# EAGLE design Lightsaber (EAGLE 9.6.2)
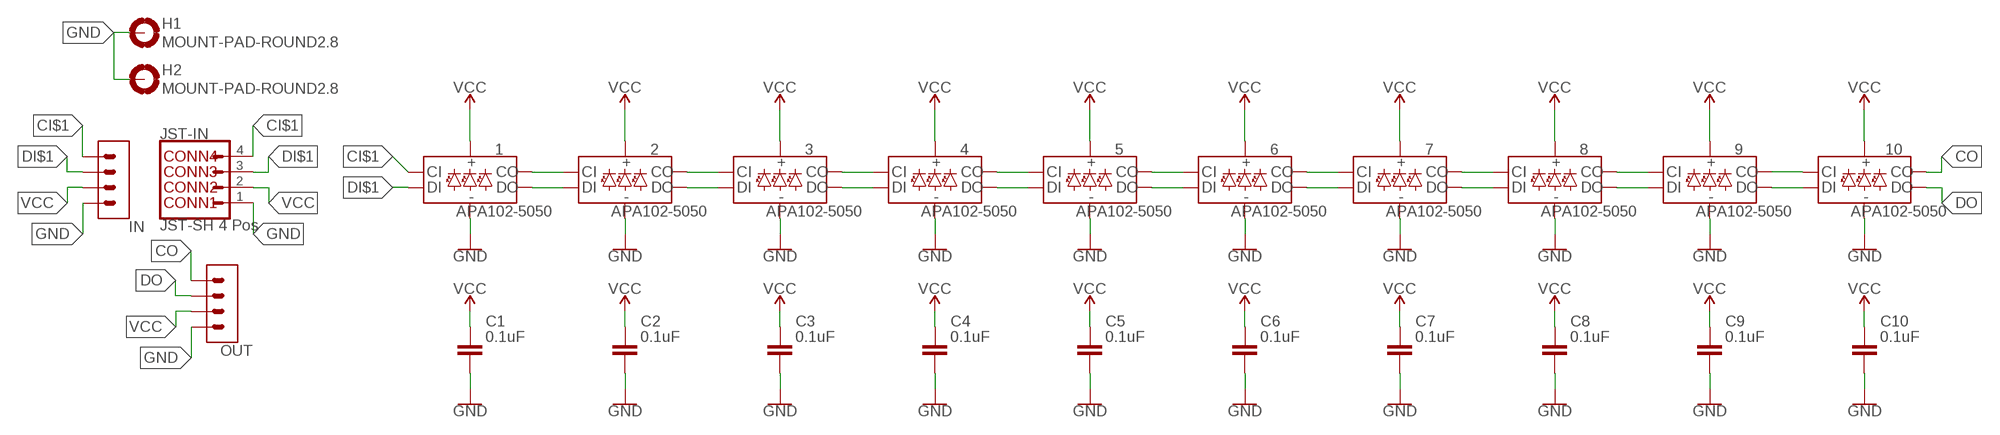
[diagram p0: schematic, sheet 1]

## Parts
1  APA102-5050  [APA102-5050]
2  APA102-5050  [APA102-5050]
3  APA102-5050  [APA102-5050]
4  APA102-5050  [APA102-5050]
5  APA102-5050  [APA102-5050]
6  APA102-5050  [APA102-5050]
7  APA102-5050  [APA102-5050]
8  APA102-5050  [APA102-5050]
9  APA102-5050  [APA102-5050]
10  APA102-5050  [APA102-5050]
C1  0.1uF  C_CHIP-0805(2012-METRIC)  [CAPC2012X110]
C2  0.1uF  C_CHIP-0805(2012-METRIC)  [CAPC2012X110]
C3  0.1uF  C_CHIP-0805(2012-METRIC)  [CAPC2012X110]
C4  0.1uF  C_CHIP-0805(2012-METRIC)  [CAPC2012X110]
C5  0.1uF  C_CHIP-0805(2012-METRIC)  [CAPC2012X110]
C6  0.1uF  C_CHIP-0805(2012-METRIC)  [CAPC2012X110]
C7  0.1uF  C_CHIP-0805(2012-METRIC)  [CAPC2012X110]
C8  0.1uF  C_CHIP-0805(2012-METRIC)  [CAPC2012X110]
C9  0.1uF  C_CHIP-0805(2012-METRIC)  [CAPC2012X110]
C10  0.1uF  C_CHIP-0805(2012-METRIC)  [CAPC2012X110]
H1  MOUNT-PAD-ROUND2.8  [2,8-PAD]
H2  MOUNT-PAD-ROUND2.8  [2,8-PAD]
IN  62000411121  [62000411121]
JST-IN  JST-SH 4 Pos  JST-4-SH  [JST04_1MM_VERT]
OUT  62000411121  [62000411121]

## Nets
CI$1: 1.P2(CI) IN.4 JST-IN.4
CI$2: 1.P5(CO) 2.P2(CI)
CI$3: 2.P5(CO) 3.P2(CI)
CI$4: 3.P5(CO) 4.P2(CI)
CI$5: 4.P5(CO) 5.P2(CI)
CI$6: 5.P5(CO) 6.P2(CI)
CI$7: 6.P5(CO) 7.P2(CI)
CI$8: 7.P5(CO) 8.P2(CI)
CI$9: 8.P5(CO) 9.P2(CI)
CI$10: 9.P5(CO) 10.P2(CI)
CO: 10.P5(CO) OUT.4
DI$1: 1.P1(DI) IN.3 JST-IN.3
DI$2: 1.P6(DO) 2.P1(DI)
DI$3: 2.P6(DO) 3.P1(DI)
DI$4: 3.P6(DO) 4.P1(DI)
DI$5: 4.P6(DO) 5.P1(DI)
DI$6: 5.P6(DO) 6.P1(DI)
DI$7: 6.P6(DO) 7.P1(DI)
DI$8: 7.P6(DO) 8.P1(DI)
DI$9: 8.P6(DO) 9.P1(DI)
DI$10: 9.P6(DO) 10.P1(DI)
DO: 10.P6(DO) OUT.3
GND: 1.P3(GND) 2.P3(GND) 3.P3(GND) 4.P3(GND) 5.P3(GND) 6.P3(GND) 7.P3(GND) 8.P3(GND) 9.P3(GND) 10.P3(GND) C1.2 C2.2 C3.2 C4.2 C5.2 C6.2 C7.2 C8.2 C9.2 C10.2 H1.B2,8(MOUNT) H2.B2,8(MOUNT) IN.1 JST-IN.1 OUT.1
VCC: 1.P4(VCC) 2.P4(VCC) 3.P4(VCC) 4.P4(VCC) 5.P4(VCC) 6.P4(VCC) 7.P4(VCC) 8.P4(VCC) 9.P4(VCC) 10.P4(VCC) C1.1 C2.1 C3.1 C4.1 C5.1 C6.1 C7.1 C8.1 C9.1 C10.1 IN.2 JST-IN.2 OUT.2

## Library data of the parts
1-10 = SparkFun-LED:APA102: Addressable RGB LED - 2 Wire Common names: APA102, Dotstar, etc. Packages: 5050 2020 SparkFun Products: SparkFun Lumenati Boards <https://www.sparkfun.com/categories/405>; PROD_ID: DIO-13739
C1-C10 = Capacitor:C: Capacitor - Generic; CATEGORY: Capacitor
H1 H2 = holes:MOUNT-PAD-ROUND: MOUNTING PAD, round
IN OUT = Headers:62000411121: THT Vertical Pin Header WR-PHD, Pitch 2.00 mm, Single Row, 4 pins Manufacturer's datasheet <https://datasheet.octopart.com/62000411121-W%C3%BCrth-Elektronik-datasheet-117282003.pdf>; CREATED_BY: PCBLayout.com; MANUFACTURER: Würth Elektronik; MPN: 62000411121
JST-IN = custom:JST-4-SH: JST-SH 4 position connector An SMD 1mm pitch JST-SH connector. Compatible with SparkFun Qwiic connectors.; PROD_ID: CONN-14483; VALUE: Vertical JST-SH 4 Position Connector

## Board
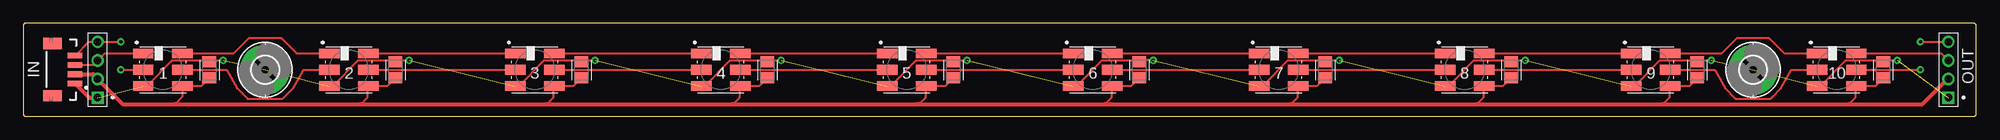
[diagram p1: board, top side]
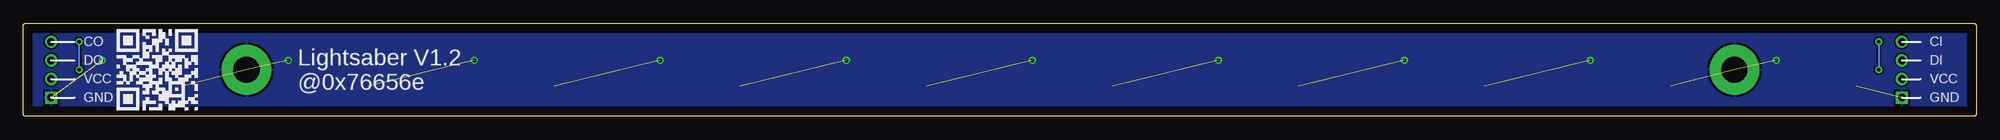
[diagram p2: board, bottom side, seen from below]

Size 210 x 10 mm. Coordinates in mm from the lower left corner, seen from the top.
Outline: 0,9.75 0,0.25 arc90 0.25,0 209.75,0 arc90 210,0.25 210,9.75 arc90 209.75,10 0.25,10 arc90 0,9.75
Copper layers (1*16): Top 0.035mm / dielectric 1.5mm / Bottom 0.035mm
Design rules "default *": minimum track width 6mil, minimum drill 0.35mm, track to track 6mil, track to pad 6mil, pad to pad 6mil, via to via 6mil, smd to smd 6mil, copper to edge 40mil, drill to drill 6mil, minimum pad ring 10mil, minimum via ring 8mil, stop-mask expansion 4mil, vias tented up to drill 0.36mm, thermal gap 10mil

### Footprints (pad centres in the part's own frame; a part is rotated, then mirrored left to right if it is on the bottom)
APA102-5050 = smd 1 x 2.2: P1 -1.75,-2.1; P3 1.75,-2.1; P4 1.75,2.1; P6 -1.75,2.1 | smd 1.1 x 2.2: P2 0,-2.1; P5 0,2.1
CAPC2012X110 = smd 1.165 x 1.465: 1 -0.875,0; 2 0.875,0
2,8-PAD = drill 2.8 pad 5.334: B2,8 0,0
62000411121 = drill 0.8 square: 1 -3,0 | drill 0.8: 2 -1,0; 3 1,0; 4 3,0
JST04_1MM_VERT = smd 0.6 x 1.55: 1 -1.478,0.775; 2 -0.478,0.775; 3 0.522,0.775; 4 1.522,0.775 | smd 1.2 x 2: NC1 -2.778,3.2; NC2 2.822,3.2

### Placement (x,y rotation side)
1  15,5 270 top
2  35,5 270 top
3  55,5 270 top
4  75,5 270 top
5  95,5 270 top
6  115,5 270 top
7  135,5 270 top
8  155,5 270 top
9  175,5 270 top
10  195,5 270 top
C1  20,5 90 top
C2  40,5 90 top
C3  60,5 90 top
C4  80,5 90 top
C5  100,5 90 top
C6  120,5 90 top
C7  140,5 90 top
C8  160,5 90 top
C9  180,5 90 top
C10  200,5 90 top
H1  26,5 0 top
H2  186,5 0 top
IN  8,5 90 top
JST-IN  6.35,5 90 top
OUT  207,5 90 top

### Tracks (layer width: path | path; a pad name or v marks a point on that pad's centre or on a via)
CI$1  (via drill 0.35)
  Top 0.2: JST-IN.4 7.05,8 IN.4 v10.5,8 | v10.5,5 1.P2
  Bottom 0.2: v10.5,8 v10.5,5
CI$2
  Top 0.2: 1.P5 21.87,5 23,3 24.12,1.88 27.88,1.88 29,3 30.13,5 2.P2
CI$3
  Top 0.2: 2.P5 3.P2
CI$4
  Top 0.2: 3.P5 4.P2
CI$5
  Top 0.2: 4.P5 5.P2
CI$6
  Top 0.2: 5.P5 6.P2
CI$7
  Top 0.2: 6.P5 7.P2
CI$8
  Top 0.2: 7.P5 8.P2
CI$9
  Top 0.2: 8.P5 9.P2
CI$10
  Top 0.152: 187.9,1.9 188.05,2.05
  Top 0.2: 9.P5 181.87,5 183,3 184.1,1.9 187.9,1.9 | 10.P2 190.13,5 189,3 188.05,2.05
CO  (via drill 0.35)
  Top 0.2: 10.P5 v204,5 | v204,8 OUT.4
  Bottom 0.2: v204,5 v204,8
DI$1
  Top 0.2: JST-IN.3 7.52,5.52 IN.3 8.75,6.75 1.P1
DI$2
  Top 0.2: 1.P6 22.62,6.75 24.29,8.42 27.71,8.42 29.38,6.75 2.P1
DI$3
  Top 0.2: 2.P6 3.P1
DI$4
  Top 0.2: 3.P6 4.P1
DI$5
  Top 0.2: 4.P6 5.P1
DI$6
  Top 0.2: 5.P6 6.P1
DI$7
  Top 0.2: 6.P6 7.P1
DI$8
  Top 0.2: 7.P6 8.P1
DI$9
  Top 0.2: 8.P6 9.P1
DI$10
  Top 0.2: 9.P6 182.62,6.75 184.29,8.42 187.71,8.42 189.38,6.75 10.P1
DO
  Top 0.2: 10.P6 206.25,6.75 OUT.3
GND  (via drill 0.35)  (13 unrouted)
  Top 0.2: v21.5,6 20.12,6 C1.2 19.88,6 16,6 13.25,3.25 1.P3 | v41.5,6 40.12,6 C2.2 39.88,6 36,6 33.25,3.25 2.P3 | C3.2 60.06,5.94 | 60.06,5.94 60.12,6 v61.5,6 | C4.2 80.12,6 | v81.5,6 80.12,6 | v101.5,6 100.12,6 C5.2 99.88,6 96,6 93.25,3.25 5.P3 | C7.2 140.12,6 | v141.5,6 140.12,6 | v161.5,6 160.12,6 C8.2 159.88,6 156,6 153.25,3.25 8.P3 | C9.2 180.12,6 | v181.5,6 180.12,6 | C10.2 200.06,5.94 | 200.06,5.94 200.12,6 v201.5,6 | 3.P3 53.25,3.25 56,6 60,6 60.06,5.94 | 4.P3 73.25,3.25 76,6 80.12,6 | 6.P3 113.25,3.25 116,6 119.88,6 | 119.88,6 C6.2 | 7.P3 133.25,3.25 136,6 140.12,6 | 9.P3 173.25,3.25 176,6 180.12,6 | 10.P3 193.25,3.25 196,6 200,6 200.06,5.94 | v121.5,6 119.88,6
  Top 0.406: JST-IN.1 7.1,2 IN.1
  pour Bottom: 0,0 0,10 210,10 210,0
VCC
  Top 0.152: 206.88,4 OUT.2
  Top 0.2: C1.1 19.12,3.25 1.P4 17.1,2.1 16.32,1.32 | C2.1 39.12,3.25 2.P4 37,3.15 37,2 36.32,1.32 | C3.1 59.12,3.25 3.P4 57,3.15 57,2 56.32,1.32 | C4.1 79.12,3.25 4.P4 77,3.15 77,2 76.32,1.32 | C5.1 99.12,3.25 5.P4 97,3.15 97,2 96.32,1.32 | C6.1 119.12,3.25 6.P4 117,3.15 117,2 116.32,1.32 | C7.1 139.12,3.25 7.P4 137,3.15 137,2 136.32,1.32 | C8.1 159.12,3.25 8.P4 157,3.15 157,2 156.32,1.32 | C10.1 199.12,3.25 10.P4 197,3.15 197,2 196.32,1.32 | C9.1 179.12,3.25 9.P4 177,3.15 177,2 176.32,1.32
  Top 0.406: JST-IN.2 7.48,4.52 IN.2 10.68,1.32 16.32,1.32 36.32,1.32 56.32,1.32 76.32,1.32 96,1.32 96.32,1.32 116.32,1.32 116.9,1.32 136.32,1.32 156.32,1.32 176.32,1.32 196.32,1.32 204.2,1.32 206.88,4

### Text on the board
bPlace: CI | CO | DI | DO | VCC | VCC | Lightsaber V1.2 / @0x76656e | GND | GND